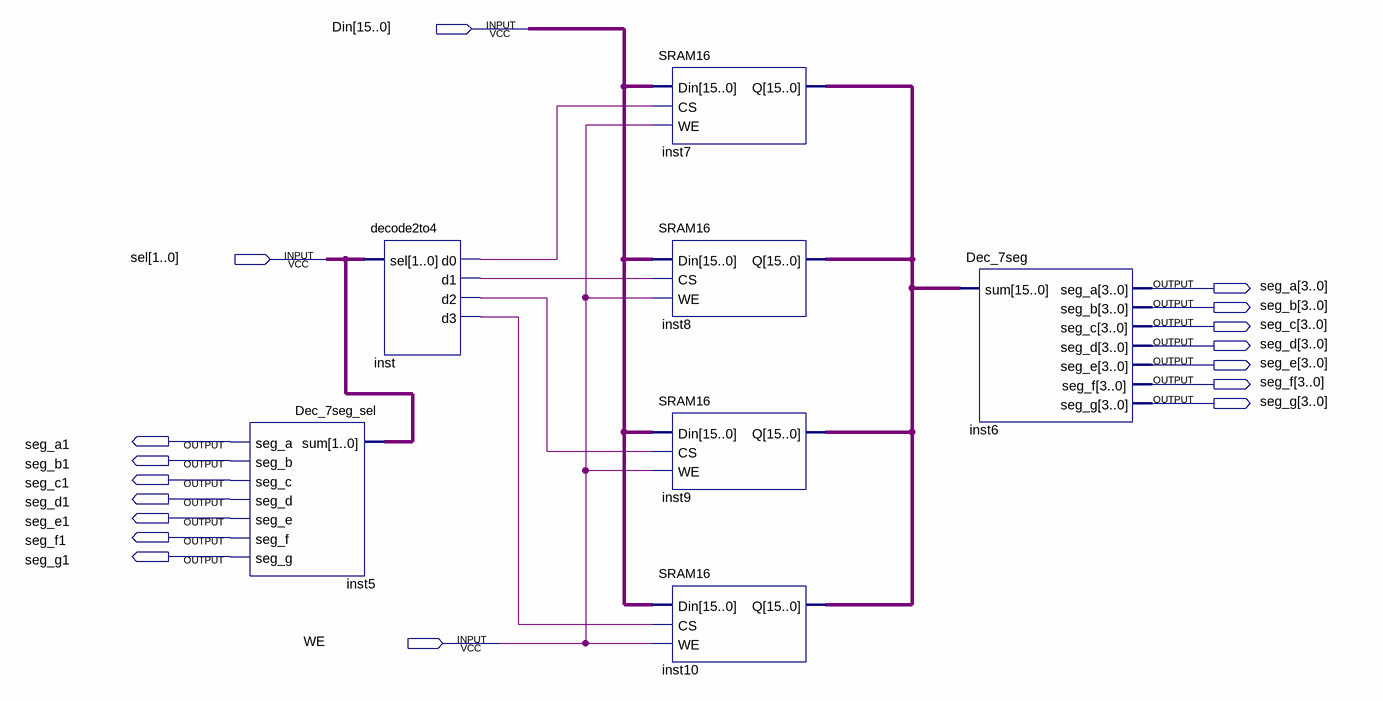
[diagram p0: schematic sheet]
// Quartus schematic 4x16_SRAM.bdf as structural Verilog: 7 symbols, 17 pins
module \4x16_SRAM  (
  input  [15:0] Din,
  input  [1:0] sel,
  input  WE,
  output [3:0] seg_a,
  output [3:0] seg_b,
  output [3:0] seg_c,
  output [3:0] seg_d,
  output [3:0] seg_e,
  output [3:0] seg_f,
  output [3:0] seg_g,
  output seg_a1,
  output seg_b1,
  output seg_c1,
  output seg_d1,
  output seg_e1,
  output seg_f1,
  output seg_g1
);

  wire inst_d0, inst_d1, inst_d2, inst_d3;
  wire [15:0] inst7_q;

  Dec_7seg_sel inst5 (
    .sum(sel), .seg_a(seg_a[1]), .seg_b(seg_b[1]), .seg_c(seg_c[1]), .seg_d(seg_d[1]), .seg_e(seg_e[1]),
    .seg_f(seg_f[1]), .seg_g(seg_g[1]));
  decode2to4 inst (.sel(sel), .d0(inst_d0), .d1(inst_d1), .d2(inst_d2), .d3(inst_d3));
  SRAM16 inst7 (.Din(Din), .CS(inst_d0), .WE(WE), .Q(inst7_q));
  SRAM16 inst8 (.Din(Din), .CS(inst_d1), .WE(WE), .Q(inst7_q));
  SRAM16 inst9 (.Din(Din), .CS(inst_d2), .WE(WE), .Q(inst7_q));
  SRAM16 inst10 (.Din(Din), .CS(inst_d3), .WE(WE), .Q(inst7_q));
  Dec_7seg inst6 (
    .sum(inst7_q), .seg_a(seg_a), .seg_b(seg_b), .seg_c(seg_c), .seg_d(seg_d), .seg_e(seg_e), .seg_f(seg_f),
    .seg_g(seg_g));

  assign seg_a1 = seg_a[1];
  assign seg_b1 = seg_b[1];
  assign seg_c1 = seg_c[1];
  assign seg_d1 = seg_d[1];
  assign seg_e1 = seg_e[1];
  assign seg_f1 = seg_f[1];
  assign seg_g1 = seg_g[1];
endmodule
